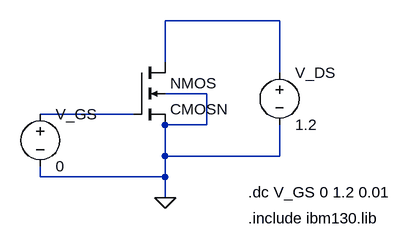
[diagram p0: schematic sim3.2.asc]
sim3.2.asc, the LTspice schematic file:
Version 4
SHEET 1 880 680
WIRE 672 192 496 192
WIRE 496 256 496 192
WIRE 672 272 672 192
WIRE 560 304 496 304
WIRE 448 336 304 336
WIRE 560 352 560 304
WIRE 560 352 496 352
WIRE 496 400 496 352
WIRE 672 400 672 352
WIRE 672 400 496 400
WIRE 304 432 304 416
WIRE 496 432 496 400
WIRE 496 432 304 432
WIRE 496 464 496 432
FLAG 496 464 0
SYMBOL CMOSN 448 256 R0
SYMATTR InstName NMOS
SYMATTR Value2 l=100n w=100n
SYMBOL voltage 672 256 R0
SYMATTR InstName V_DS
SYMATTR Value 1.2
SYMBOL voltage 304 320 R0
SYMATTR InstName V_GS
SYMATTR Value 0
TEXT 624 456 Left 2 !.dc V_GS 0 1.2 0.01
TEXT 624 496 Left 2 !.include ibm130.lib

The netlist it stands for:
* sim3.2.asc
M§NMOS N001 N002 0 0 CMOSN l=100n w=100n
V_DS N001 0 1.2
V_GS N002 0 0
.model NMOS NMOS
.model PMOS PMOS
.lib standard.mos
.dc V_GS 0 1.2 0.01
.include ibm130.lib
.backanno
.end